# Altium schematic sheet Sheet3.SchDoc
size A3; SheetNumber: 2; SheetTotal: 4
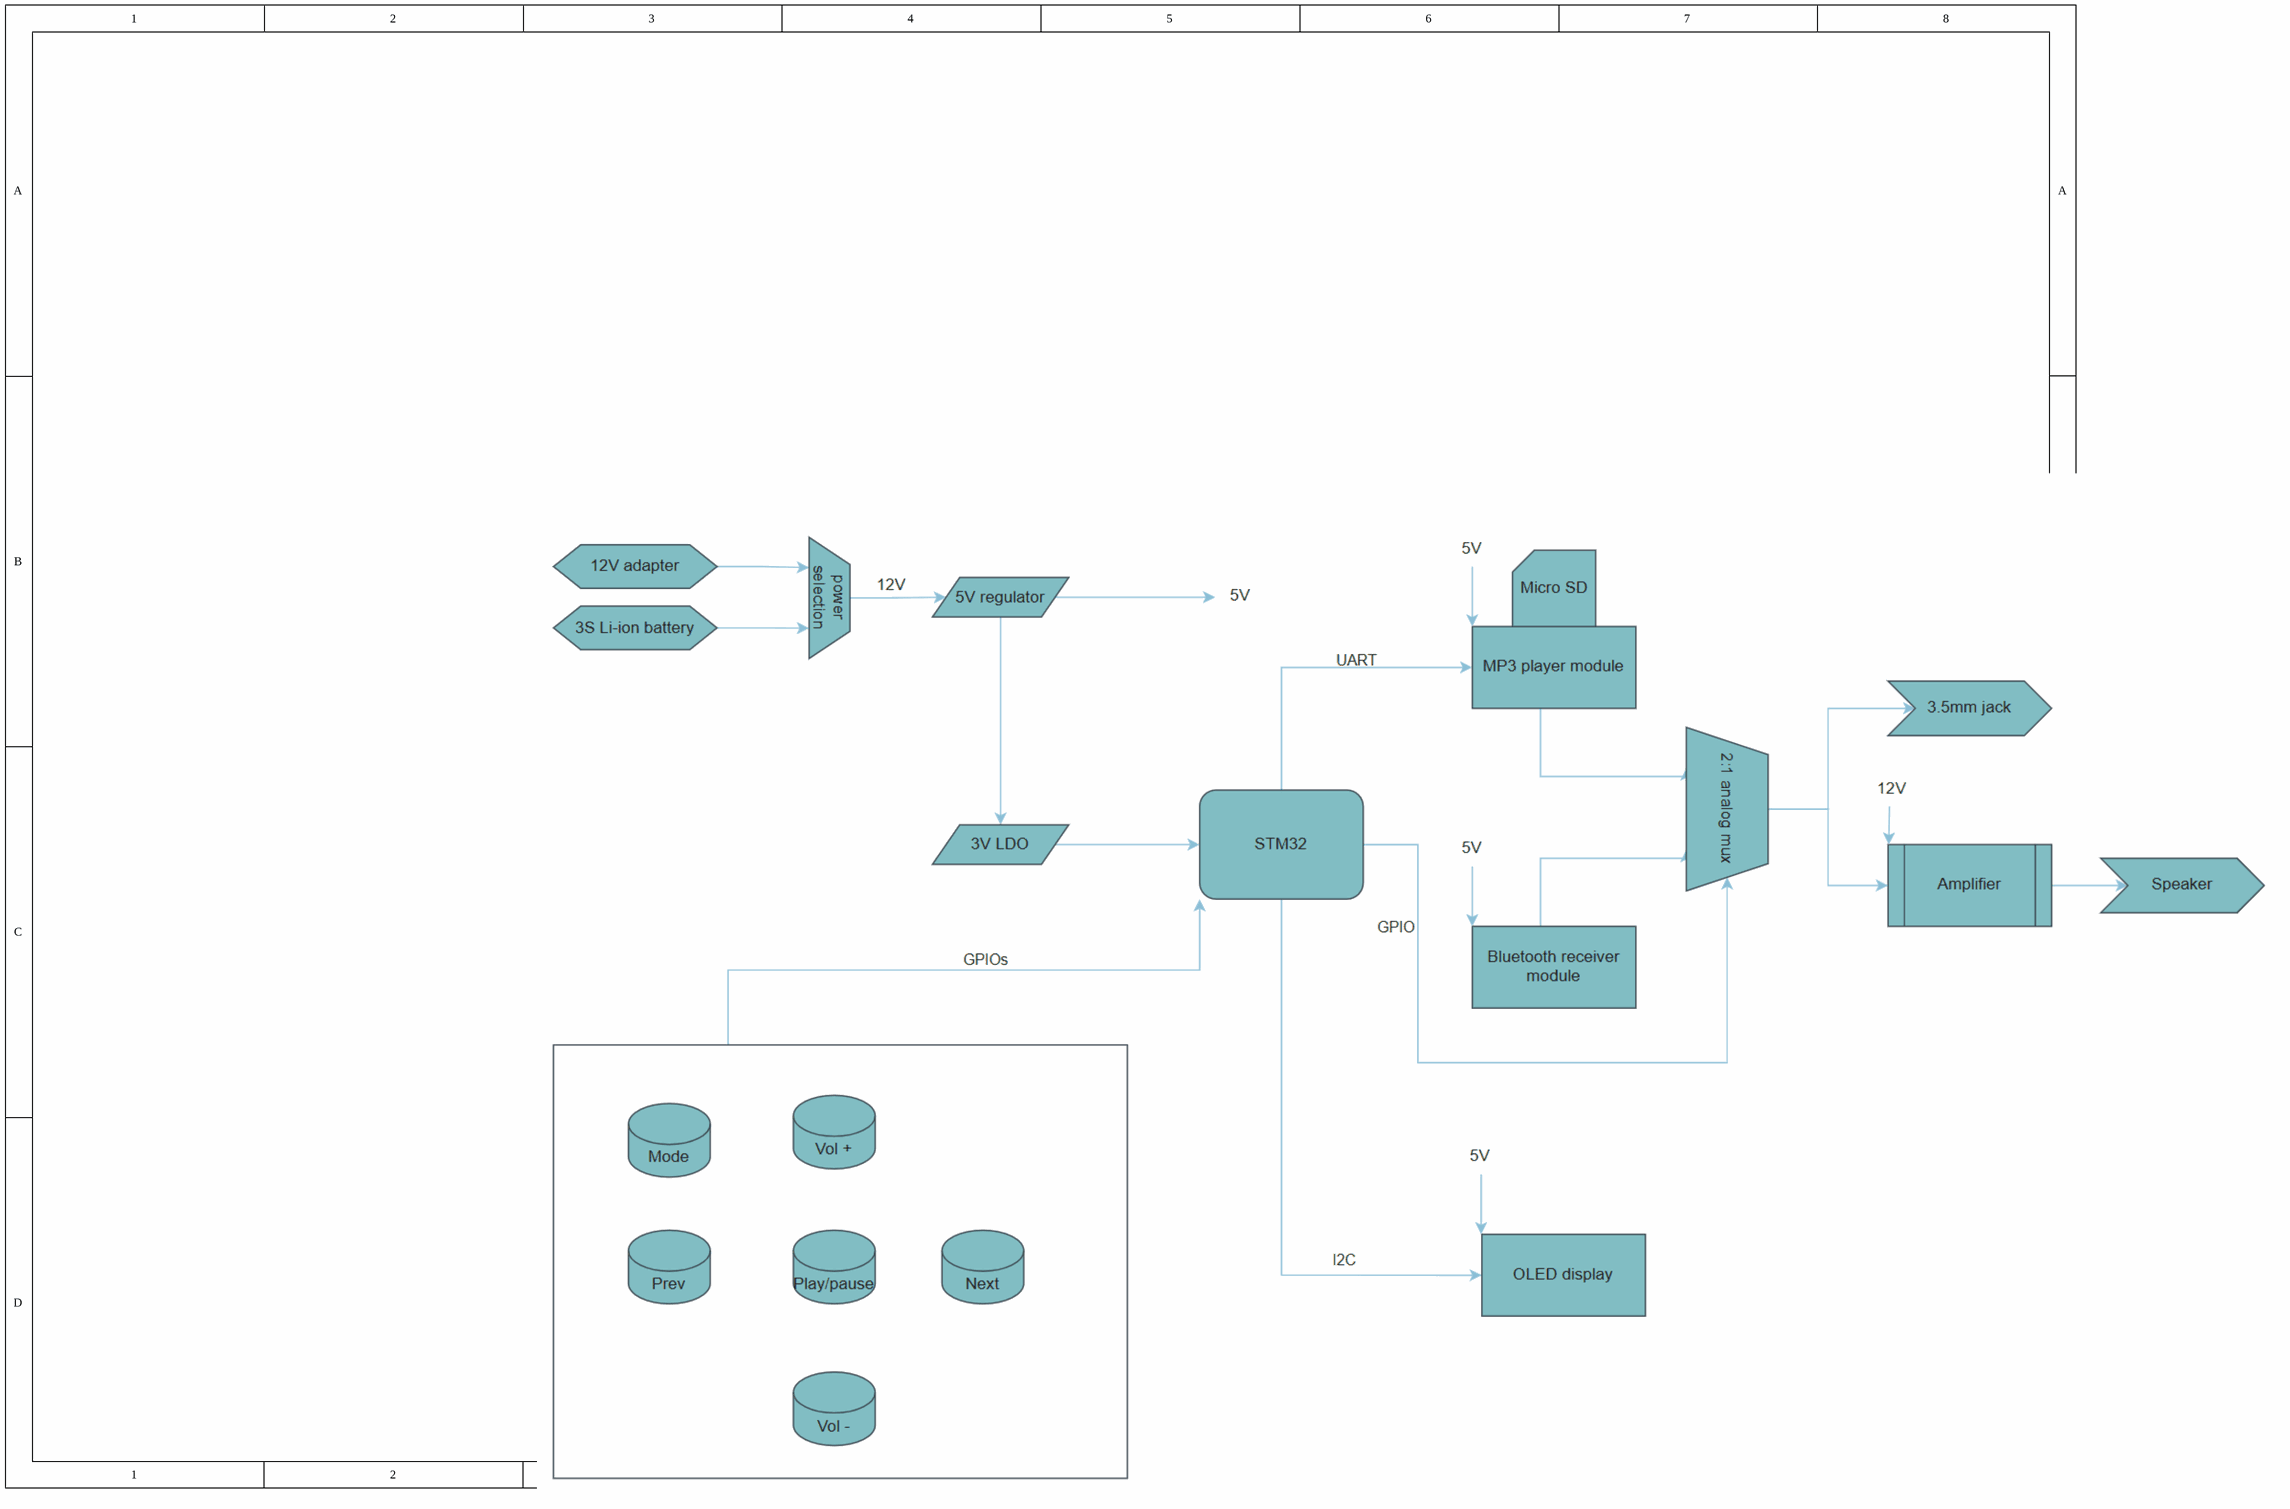
[diagram p0: Sheet3.SchDoc]

## Notes on the sheet
- PORTABLE AUDIO PLAYER
- Designed by:
- Title:
- Main system
- Group 2
- Instructed by:
- Course:
- Embedded System Design
- MSc. Bui Quoc Bao
- Version:
- Sheet
- 1
- 1.0.0
- of
- Date:
- Size:
- 13/2/2026
- A3